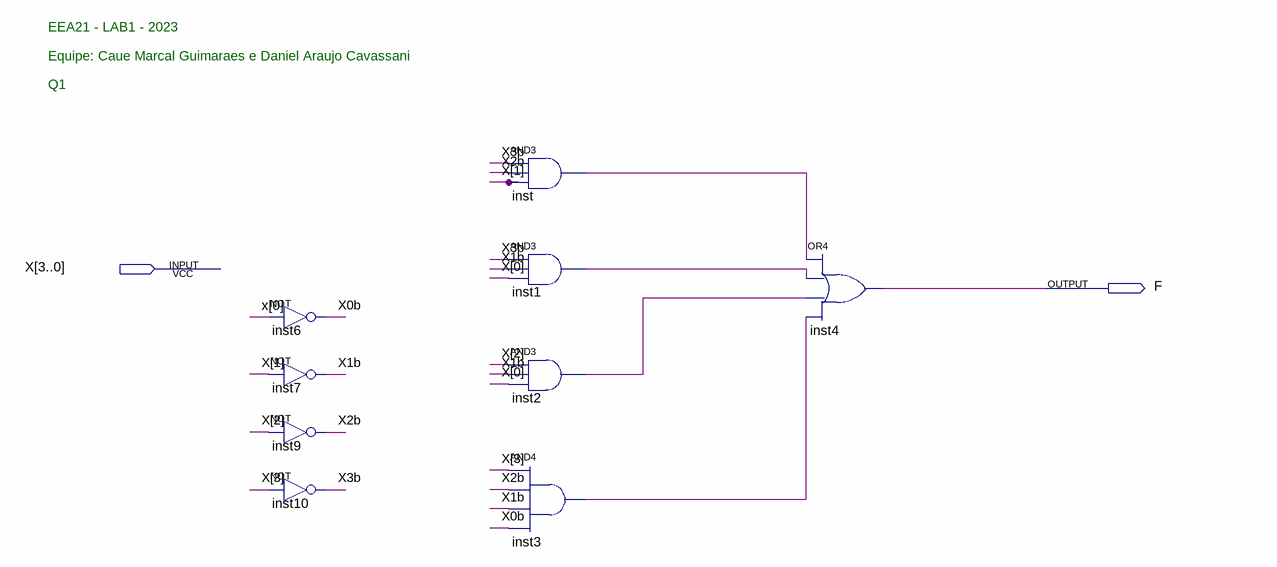
[diagram p0: schematic sheet]
// Quartus schematic q1.bdf as structural Verilog: 9 symbols, 2 pins
module q1 (
  input  [3:0] X,
  output F
);

  wire inst1_out, inst2_out, inst3_out, inst_out, X0b, X1b, X2b, X3b;

  not inst6 (X0b, X[0]);
  not inst7 (X1b, X[1]);
  not inst9 (X2b, X[2]);
  not inst10 (X3b, X[3]);
  and inst (inst_out, X3b, X2b, X[1]);
  and inst1 (inst1_out, X3b, X1b, X[0]);
  and inst2 (inst2_out, X[2], X1b, X[0]);
  and inst3 (inst3_out, X[3], X2b, X1b, X0b);
  or inst4 (F, inst_out, inst1_out, inst2_out, inst3_out);

  // Notes on the sheet:
  //   EEA21 - LAB1 - 2023
  //   Equipe: Caue Marcal Guimaraes e Daniel Araujo Cavassani
  //   Q1
endmodule
